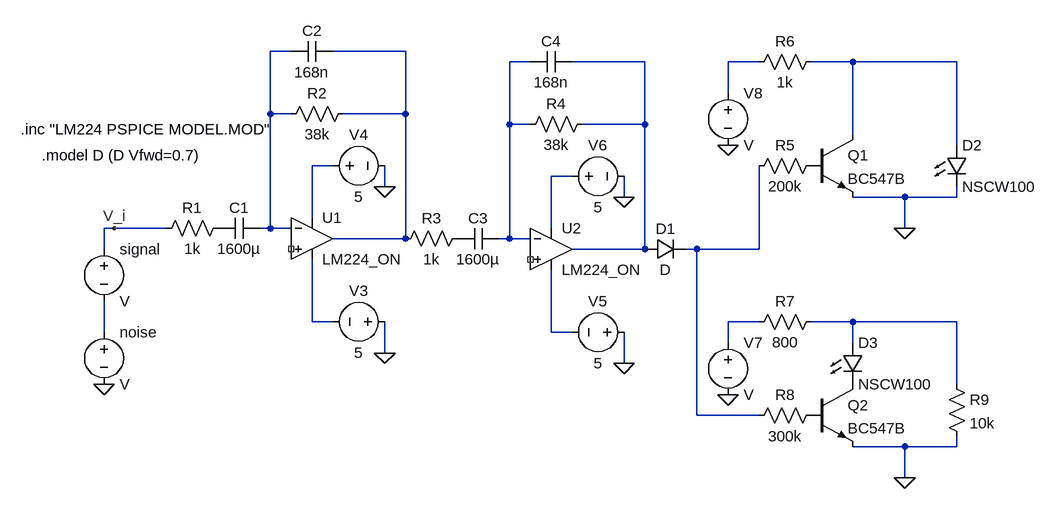
[diagram p0: schematic FullCircuit.asc]
FullCircuit.asc, the LTspice schematic file:
Version 4
SHEET 1 1368 680
WIRE 224 -128 192 -128
WIRE 400 -128 288 -128
WIRE 592 -112 560 -112
WIRE 768 -112 656 -112
WIRE 944 -112 896 -112
WIRE 1088 -112 1024 -112
WIRE 1248 -112 1088 -112
WIRE 896 -64 896 -112
WIRE 192 -32 192 -128
WIRE 224 -32 192 -32
WIRE 400 -32 400 -128
WIRE 400 -32 304 -32
WIRE 560 -16 560 -112
WIRE 592 -16 560 -16
WIRE 768 -16 768 -112
WIRE 768 -16 672 -16
WIRE 1088 0 1088 -112
WIRE 1248 16 1248 -112
WIRE 288 48 256 48
WIRE 656 64 624 64
WIRE 368 80 368 48
WIRE 736 96 736 64
WIRE 1168 96 1088 96
WIRE 1248 96 1248 80
WIRE 1248 96 1168 96
WIRE 256 128 256 48
WIRE -48 144 -64 144
WIRE 32 144 -48 144
WIRE 192 144 192 -32
WIRE 192 144 176 144
WIRE 224 144 192 144
WIRE 624 144 624 64
WIRE 1168 144 1168 96
WIRE 400 160 400 -32
WIRE 400 160 288 160
WIRE 560 160 560 -16
WIRE 560 160 544 160
WIRE 592 160 560 160
WIRE -64 176 -64 144
WIRE 768 176 768 -16
WIRE 768 176 656 176
WIRE 848 176 832 176
WIRE 944 176 944 48
WIRE 944 176 848 176
WIRE 256 288 256 192
WIRE 288 288 256 288
WIRE 944 288 896 288
WIRE 1088 288 1024 288
WIRE 1248 288 1088 288
WIRE -64 304 -64 256
WIRE 624 304 624 208
WIRE 656 304 624 304
WIRE 896 320 896 288
WIRE 1088 320 1088 288
WIRE 368 336 368 288
WIRE 736 352 736 304
WIRE 1248 384 1248 288
WIRE 848 432 848 176
WIRE 944 432 848 432
WIRE 1168 480 1088 480
WIRE 1248 480 1248 464
WIRE 1248 480 1168 480
WIRE 1168 528 1168 480
FLAG 368 336 0
FLAG 368 80 0
FLAG -64 384 0
FLAG 736 352 0
FLAG 736 96 0
FLAG 896 400 0
FLAG 1168 528 0
FLAG 1168 144 0
FLAG 896 16 0
FLAG -48 144 V_i
SYMBOL voltage -64 160 R0
SYMATTR InstName signal
SYMBOL voltage -64 288 R0
SYMATTR InstName noise
SYMBOL res 128 128 R90
WINDOW 0 0 56 VBottom 2
WINDOW 3 32 56 VTop 2
SYMATTR InstName R1
SYMATTR Value 1k
SYMBOL res 320 -48 R90
WINDOW 0 0 56 VBottom 2
WINDOW 3 32 56 VTop 2
SYMATTR InstName R2
SYMATTR Value 38k
SYMBOL cap 176 128 R90
WINDOW 0 0 32 VBottom 2
WINDOW 3 32 32 VTop 2
SYMATTR InstName C1
SYMATTR Value 1600µ
SYMBOL cap 288 -144 R90
WINDOW 0 0 32 VBottom 2
WINDOW 3 32 32 VTop 2
SYMATTR InstName C2
SYMATTR Value 168n
SYMBOL OpAmps/opamp2 256 96 R0
SYMATTR InstName U1
SYMATTR Value LM224_ON
SYMBOL voltage 384 288 R90
WINDOW 0 -32 56 VBottom 2
WINDOW 3 32 56 VTop 2
SYMATTR InstName V3
SYMATTR Value 5
SYMBOL voltage 272 48 R270
WINDOW 0 32 56 VTop 2
WINDOW 3 -32 56 VBottom 2
SYMATTR InstName V4
SYMATTR Value 5
SYMBOL res 496 144 R90
WINDOW 0 0 56 VBottom 2
WINDOW 3 32 56 VTop 2
SYMATTR InstName R3
SYMATTR Value 1k
SYMBOL res 688 -32 R90
WINDOW 0 0 56 VBottom 2
WINDOW 3 32 56 VTop 2
SYMATTR InstName R4
SYMATTR Value 38k
SYMBOL cap 544 144 R90
WINDOW 0 0 32 VBottom 2
WINDOW 3 32 32 VTop 2
SYMATTR InstName C3
SYMATTR Value 1600µ
SYMBOL cap 656 -128 R90
WINDOW 0 0 32 VBottom 2
WINDOW 3 32 32 VTop 2
SYMATTR InstName C4
SYMATTR Value 168n
SYMBOL OpAmps/opamp2 624 112 R0
SYMATTR InstName U2
SYMATTR Value LM224_ON
SYMBOL voltage 752 304 R90
WINDOW 0 -32 56 VBottom 2
WINDOW 3 32 56 VTop 2
SYMATTR InstName V5
SYMATTR Value 5
SYMBOL voltage 640 64 R270
WINDOW 0 32 56 VTop 2
WINDOW 3 -32 56 VBottom 2
SYMATTR InstName V6
SYMATTR Value 5
SYMBOL diode 768 192 R270
WINDOW 0 32 32 VTop 2
WINDOW 3 0 32 VBottom 2
SYMATTR InstName D1
SYMBOL res 1040 32 R90
WINDOW 0 0 56 VBottom 2
WINDOW 3 32 56 VTop 2
SYMATTR InstName R5
SYMATTR Value 200k
SYMBOL res 1040 -128 R90
WINDOW 0 0 56 VBottom 2
WINDOW 3 32 56 VTop 2
SYMATTR InstName R6
SYMATTR Value 1k
SYMBOL res 1040 272 R90
WINDOW 0 0 56 VBottom 2
WINDOW 3 32 56 VTop 2
SYMATTR InstName R7
SYMATTR Value 800
SYMBOL res 1040 416 R90
WINDOW 0 0 56 VBottom 2
WINDOW 3 32 56 VTop 2
SYMATTR InstName R8
SYMATTR Value 300k
SYMBOL npn 1024 0 R0
SYMATTR InstName Q1
SYMATTR Value BC547B
SYMBOL npn 1024 384 R0
SYMATTR InstName Q2
SYMATTR Value BC547B
SYMBOL LED 1232 16 R0
SYMATTR InstName D2
SYMATTR Value NSCW100
SYMBOL LED 1072 320 R0
SYMATTR InstName D3
SYMATTR Value NSCW100
SYMBOL res 1232 368 R0
SYMATTR InstName R9
SYMATTR Value 10k
SYMBOL voltage 896 304 R0
SYMATTR InstName V7
SYMBOL voltage 896 -80 R0
SYMATTR InstName V8
TEXT -160 32 Left 2 !.model D (D Vfwd=0.7)
TEXT -192 -8 Left 2 !.inc "LM224 PSPICE MODEL.MOD"

The netlist it stands for:
* FullCircuit.asc
V§signal V_i N013 V
V§noise N013 0 V
R1 P001 V_i 1k
R2 N002 N001 38k
C1 N001 P001 1600µ
C2 N002 N001 168n
XU1 NC_01 N001 N007 N010 N002 LM224_ON  ; pins In+ In- V+ V- OUT
V3 0 N010 5
V4 N007 0 5
R3 P002 N002 1k
R4 N004 N003 38k
C3 N003 P002 1600µ
C4 N004 N003 168n
XU2 NC_02 N003 N008 N014 N004 LM224_ON  ; pins In+ In- V+ V- OUT
V5 0 N014 5
V6 N008 0 5
D1 N004 N009 D
R5 P003 N009 200k
R6 N006 N005 1k
R7 N012 N011 800
R8 P004 N009 300k
Q1 N006 P003 0 0 BC547B
Q2 P005 P004 0 0 BC547B
D2 N006 0 NSCW100
D3 N012 P005 NSCW100
R9 N012 0 10k
V7 N011 0 V
V8 N005 0 V
.model D D
.lib standard.dio
.model NPN NPN
.model PNP PNP
.lib standard.bjt
.model D (D Vfwd=0.7)
.inc "LM224 PSPICE MODEL.MOD"
.backanno
.end